# EAGLE design expansion_temp (EAGLE 5.11)
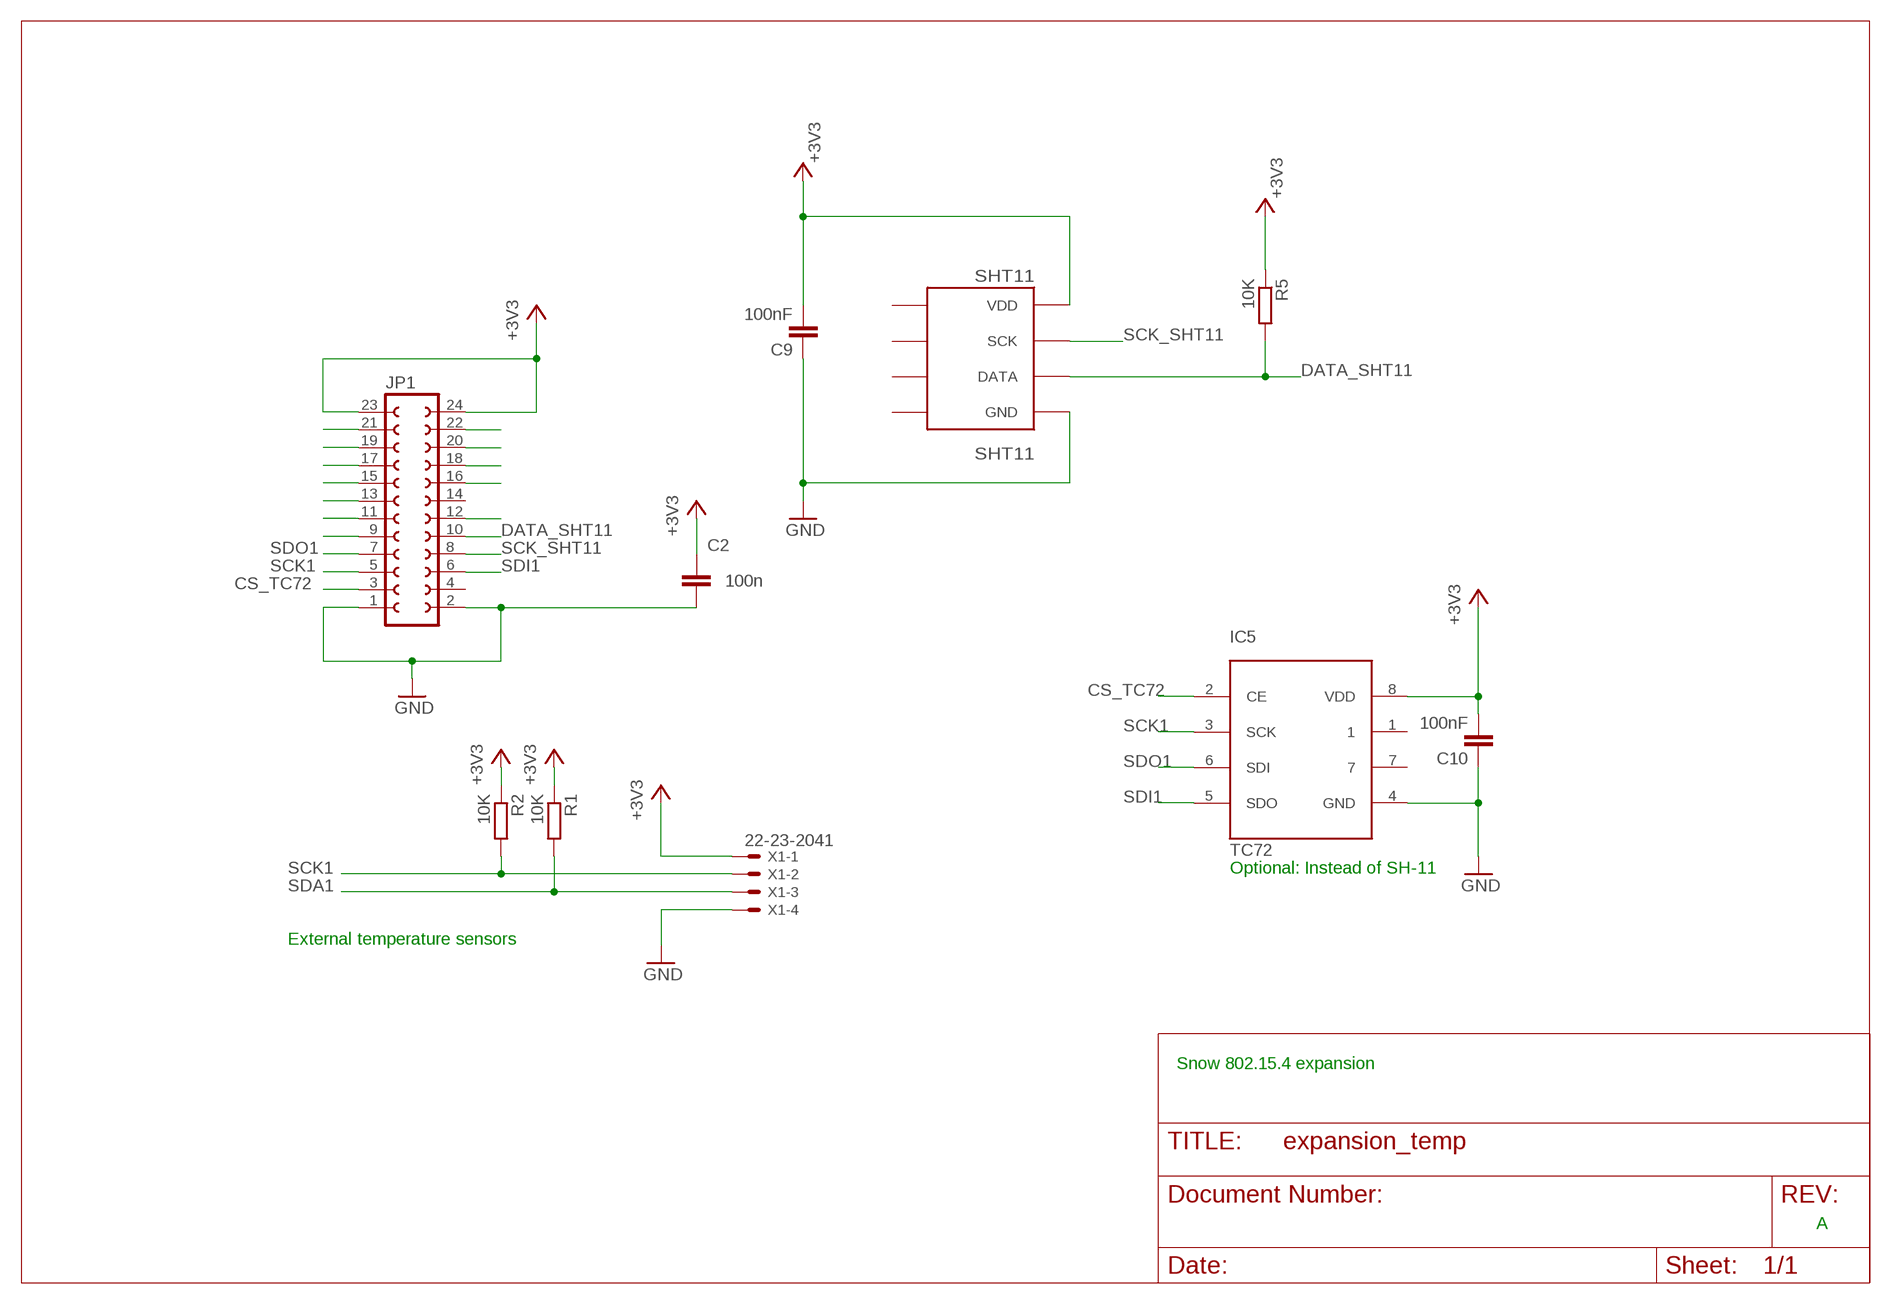
[diagram p0: schematic, sheet 1]

## Parts
C2  100n  C-EUC0805  [C0805]
C9  100nF  C-EUC0805  [C0805]
C10  100nF  C-EUC0805  [C0805]
IC5  TC72  [MSOP8]
JP1  FE12-2  [FE12-2]
R1  10K  R-EU_M0805  [M0805]
R2  10K  R-EU_M0805  [M0805]
R5  10K  R-EU_M0805  [M0805]
SHT11  SHT11  [SHT11]
X1  22-23-2041  [22-23-2041]

## Nets
+3V3: C2.1 C9.2 C10.2 IC5.8(VDD) JP1.23 JP1.24 R1.1 R2.1 R5.1 SHT11.VDD X1.1
CS_TC72: IC5.2(CE) JP1.3
DATA_SHT11: JP1.10 R5.2 SHT11.DATA
GND: C2.2 C9.1 C10.1 IC5.4(GND) JP1.1 JP1.2 SHT11.GND X1.4
INT0: JP1.18
N$9: JP1.22
N$10: JP1.20
N$12: JP1.16
N$14: JP1.12
N$21: JP1.21
N$22: JP1.19
N$23: JP1.17
N$24: JP1.15
N$25: JP1.13
N$26: JP1.11
N$27: JP1.9
SCK1: IC5.3(SCK) JP1.5 R2.2 X1.2
SCK_SHT11: JP1.8 SHT11.SCK
SDA1: R1.2 X1.3
SDI1: IC5.5(SDO) JP1.6
SDO1: IC5.6(SDI) JP1.7
Unconnected: IC5.1 IC5.7 JP1.4 JP1.14 SHT11.5 SHT11.6 SHT11.7 SHT11.8

## Notes on the sheet
- Optional: Instead of SH-11
- External temperature sensors
- Snow 802.15.4 expansion
- A

## Library data of the parts
C2 C9 C10 = rcl:C-EU: CAPACITOR, European symbol
IC5 = miwi:TC72
JP1 = con-lsta:FE12-2: FEMALE HEADER; OC_FARNELL: unknown; OC_NEWARK: unknown
R1 R2 R5 = rcl:R-EU_: RESISTOR, European symbol
SHT11 = sht11:SHT11
X1 = con-molex:22-23-2041: .100" (2.54mm) Center Header - 4 Pin; MF: MOLEX; MPN: 22-23-2041; OC_FARNELL: 1462920; OC_NEWARK: 38C0355

## Board
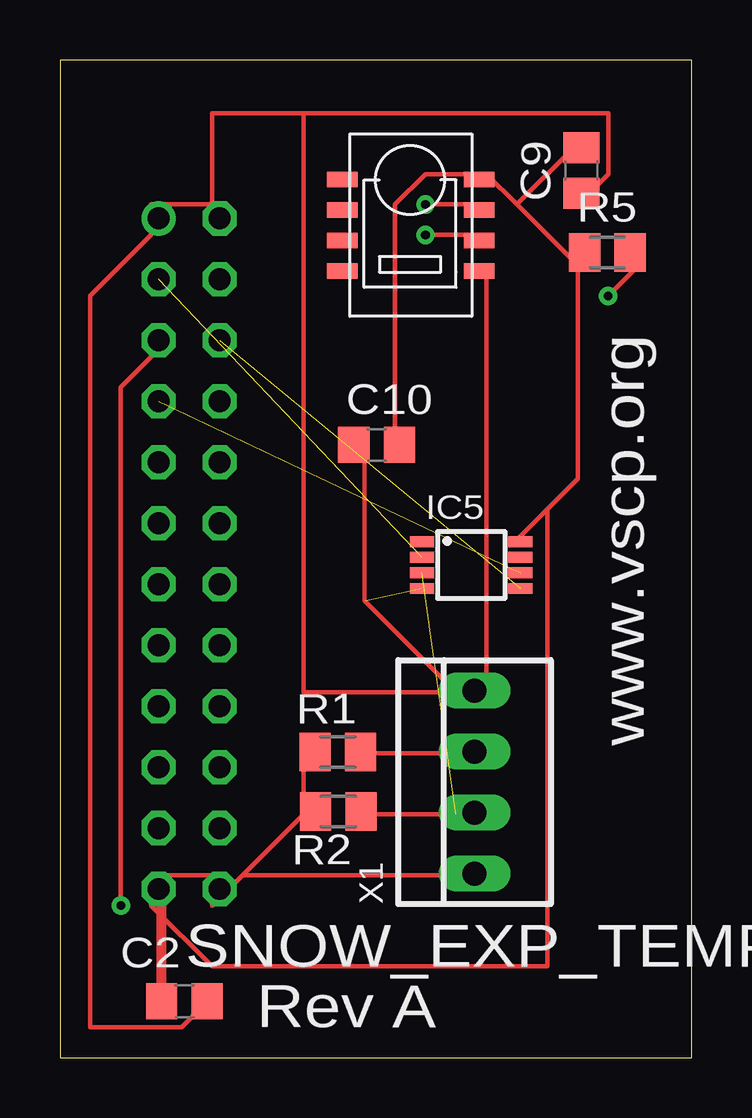
[diagram p1: board, top side]
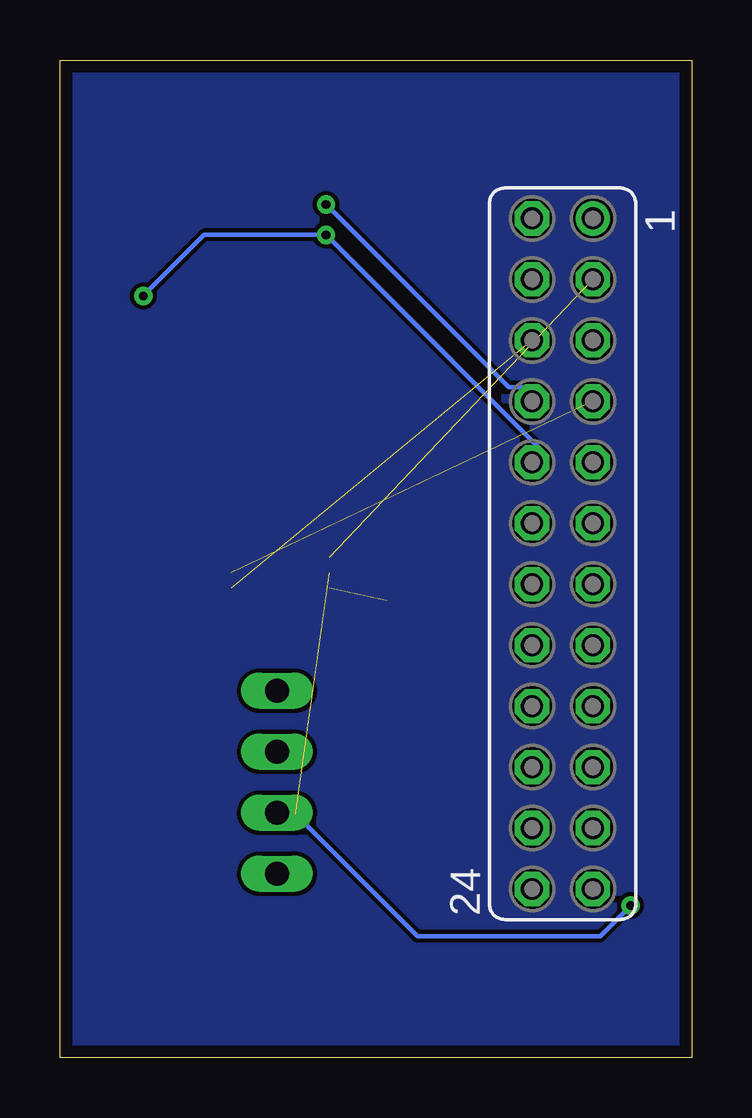
[diagram p2: board, bottom side, seen from below]

Size 26.33 x 41.58 mm. Coordinates in mm from the lower left corner, seen from the top.
Outline: 0,0 26.33,0 26.33,41.58 0,41.58 0,0
Copper layers (1*16): Top 0.0356mm / dielectric 1.5011mm / Bottom 0.0356mm
Design rules "SilverCircuits": minimum track width 7mil, minimum drill 14mil, track to track 7mil, track to pad 7mil, pad to pad 7mil, via to via 7mil, smd to smd 0mil, copper to edge 20mil, drill to drill 8mil, minimum pad ring 10mil, minimum via ring 8mil, stop-mask expansion 4mil, vias tented up to drill 0mil, thermal gap 10mil

### Footprints (pad centres in the part's own frame; a part is rotated, then mirrored left to right if it is on the bottom)
C0805 = smd 1.3 x 1.5: 1 -0.95,0; 2 0.95,0
MSOP8 = smd 1 x 0.45: 1 -2.05,0.975; 2 -2.05,0.325; 3 -2.05,-0.325; 4 -2.05,-0.975; 5 2.05,-0.975; 6 2.05,-0.325; 7 2.05,0.325; 8 2.05,0.975
FE12-2 = drill 0.914 round: 1 -13.97,1.27 | drill 0.914 octagon: 2 -13.97,-1.27; 3 -11.43,1.27; 4 -11.43,-1.27; 5 -8.89,1.27; 6 -8.89,-1.27; 7 -6.35,1.27; 8 -6.35,-1.27; 9 -3.81,1.27; 10 -3.81,-1.27; 11 -1.27,1.27; 12 -1.27,-1.27; 13 1.27,1.27; 14 1.27,-1.27; 15 3.81,1.27; 16 3.81,-1.27; 17 6.35,1.27; 18 6.35,-1.27; 19 8.89,1.27; 20 8.89,-1.27; 21 11.43,1.27; 22 11.43,-1.27; 23 13.97,1.27; 24 13.97,-1.27
M0805 = smd 1.3 x 1.6: 1 -0.95,0; 2 0.95,0
SHT11 = smd 1.27 x 0.635: 5 3.5,-2.54; 6 3.5,-1.27; 7 3.5,0; 8 3.5,1.27; DATA -2.22,0; GND -2.22,1.27; SCK -2.22,-1.27; VDD -2.22,-2.54
22-23-2041 = drill 1 long: 1 -3.81,0; 2 -1.27,0; 3 1.27,0; 4 3.81,0

### Placement (x,y rotation side)
C2  5.19,2.36 0 top
C9  21.74,36.98 90 top
C10  13.2,25.54 0 top
IC5  17.15,20.54 0 top
JP1  5.38,21.01 270 bottom
R1  11.58,12.74 0 top
R2  11.61,10.27 0 top
R5  22.82,33.56 0 top
SHT11  15.27,34.06 180 top
X1  17.29,11.49 90 top

### Tracks (layer width: path | path; a pad name or v marks a point on that pad's centre or on a via)
+3V3
  Top 0.178: 10.16,10.16 10.16,12.7 R1.1 | 7.62,7.62 6.35,6.35 JP1.24 6.35,7.62 3.81,7.62 JP1.23 3.81,6.35 6.35,3.81 20.32,3.81 20.32,22.86 | 7.62,7.62 10.16,10.16 | 10.16,10.16 R2.1 | 7.62,7.62 16.51,7.62 X1.1 | 20.32,22.86 21.59,24.13 21.59,33.02 | 20.32,22.86 19.05,21.59 IC5.8 | 21.59,33.02 19.05,35.56 | 19.05,35.56 17.78,36.83 | 21.59,33.02 R5.1 | 17.78,36.83 15.24,36.83 13.97,35.56 13.97,25.4 C10.2 | 17.78,36.83 SHT11.VDD | 19.05,35.56 21.59,38.1 C9.2
  Top 0.406: JP1.23 4.24,7.04 C2.1
CS_TC72  (1 unrouted)
DATA_SHT11  (via drill 0.36)
  Top 0.178: v15.24,34.29 17.78,34.29 SHT11.DATA | v22.86,31.75 24.13,33.02 R5.2
  Bottom 0.178: JP1.10 6.35,25.4 v15.24,34.29 20.32,34.29 v22.86,31.75
GND  (1 unrouted)
  Top 0.178: SHT11.GND 17.78,33.02 17.78,15.24 X1.4 16.51,15.24 | 16.51,15.24 12.7,19.05 12.7,25.4 C10.1 | 10.16,39.37 6.35,39.37 6.35,35.56 | 10.16,39.37 22.86,39.37 22.86,36.83 21.59,35.56 C9.1 | C2.2 6.35,2.54 5.08,1.27 1.27,1.27 1.27,31.75 3.81,34.29 JP1.1 3.81,35.56 6.35,35.56 | 6.35,35.56 JP1.2 | 16.51,15.24 10.16,15.24 10.16,39.37
N$1
  pour Bottom: 0.28,41.29 0.25,41.29 0.4,-0.06 25.61,0.23 26.41,0.68 26.16,0.61 26.16,41.81 0.51,41.37 0.51,40.95
SCK1  (via drill 0.36)  (1 unrouted)
  Top 0.178: R2.2 12.7,10.16 16.51,10.16 X1.2 | v2.54,6.35 2.54,27.94 3.81,29.21 JP1.5
  Bottom 0.178: v2.54,6.35 3.81,5.08 11.43,5.08 16.51,10.16 X1.2
SCK_SHT11  (via drill 0.36)
  Top 0.178: v15.24,35.56 17.78,35.56 SHT11.SCK
  Bottom 0.178: v15.24,35.56 7.62,27.94 6.35,27.94 JP1.8
SDA1
  Top 0.178: R1.2 12.7,12.7 16.51,12.7 X1.3
SDI1  (1 unrouted)
SDO1  (1 unrouted)

### Text on the board
tNames: www.vscp.org | SNOW_EXP_TEMP | Rev A